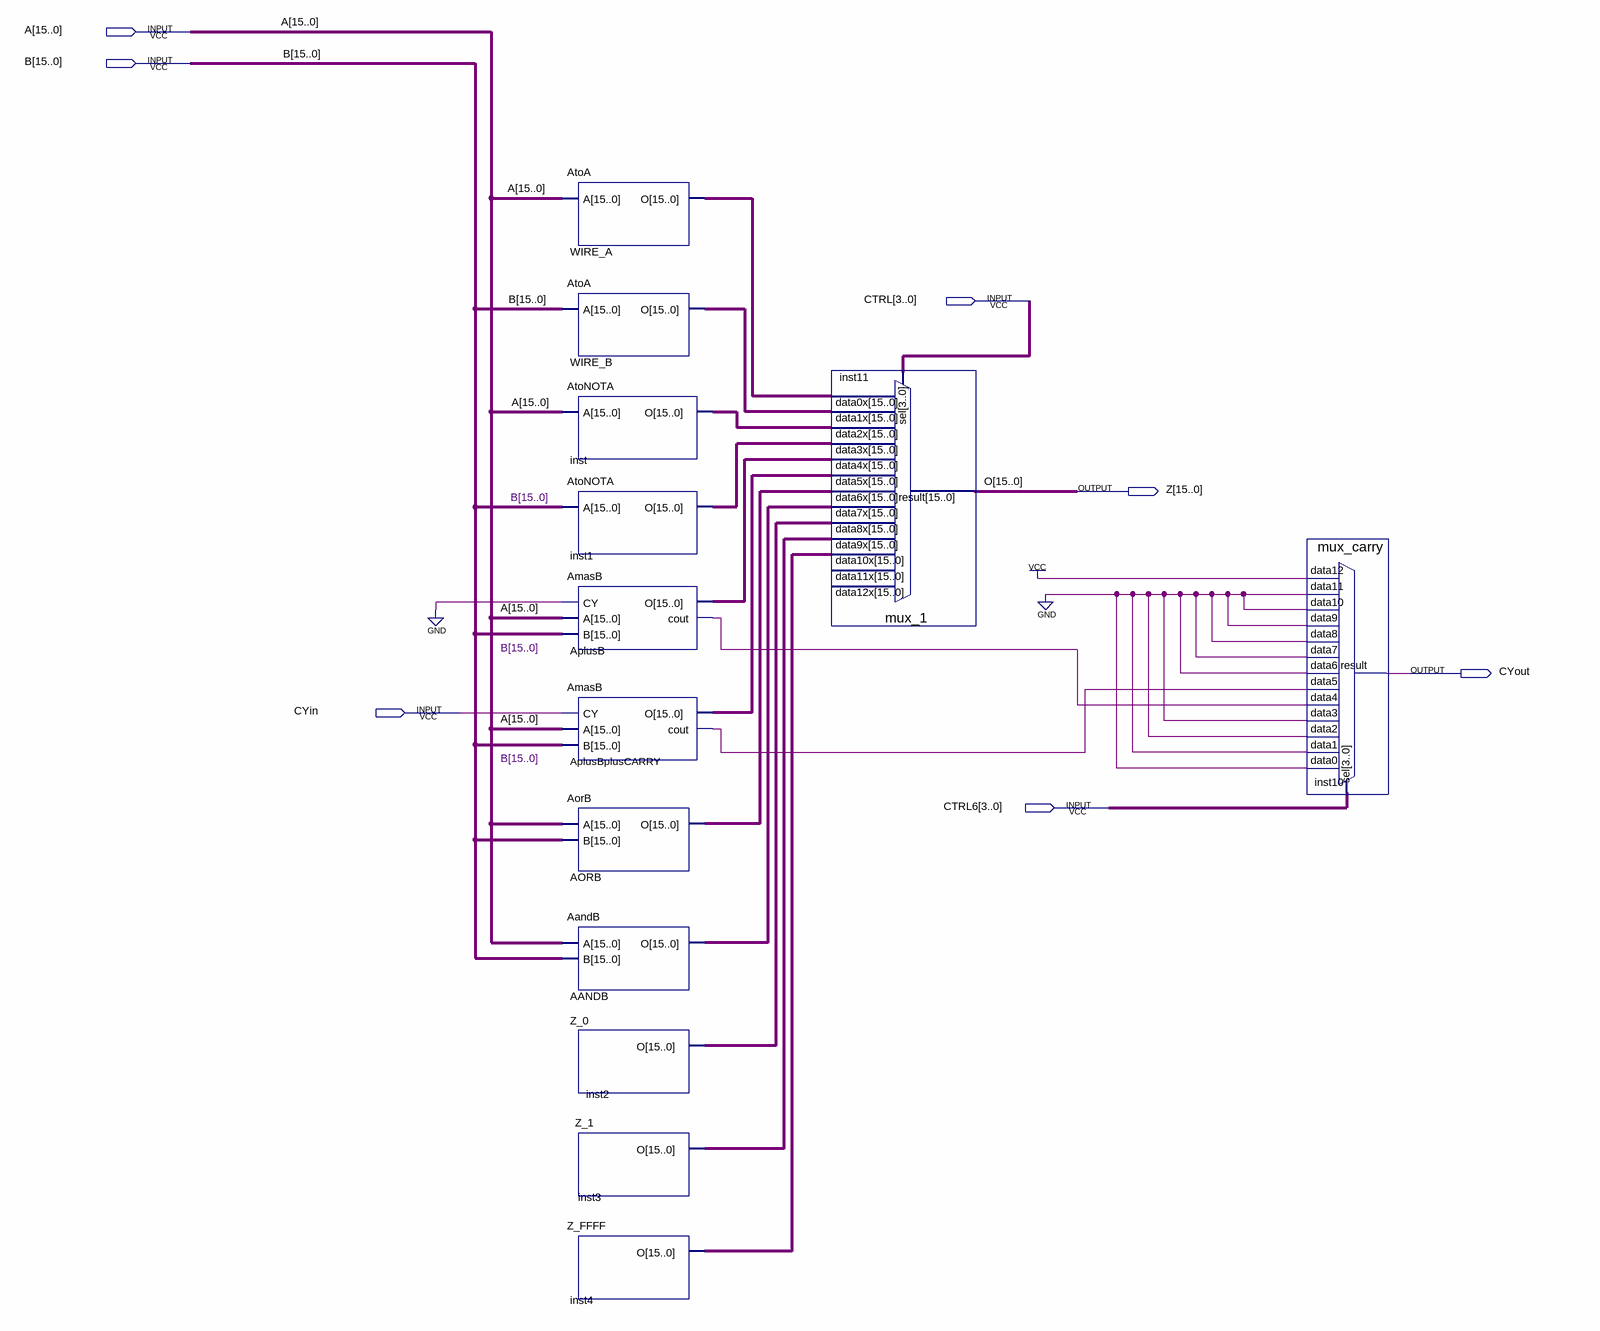
[diagram p0: schematic sheet]
// Quartus schematic ALU.bdf as structural Verilog: 13 symbols, 7 pins
module ALU (
  input  [15:0] A,
  input  [15:0] B,
  input  [3:0] CTRL,
  input  CYin,
  input  [3:0] CTRL6,
  output [15:0] Z,
  output CYout
);

  wire AplusB_cout, AplusBplusCARRY_cout;
  wire [15:0] AANDB_o, AORB_o, AplusB_o, AplusBplusCARRY_o, inst1_o, inst2_o, inst3_o, inst4_o, inst_o,
       WIRE_A_o, WIRE_B_o;

  AtoA WIRE_A (.A(A), .O(WIRE_A_o));
  AtoA WIRE_B (.A(B), .O(WIRE_B_o));
  AtoNOTA inst (.A(A), .O(inst_o));
  AtoNOTA inst1 (.A(B), .O(inst1_o));
  AmasB AplusB (.CY(1'b0), .A(A), .B(B), .O(AplusB_o), .cout(AplusB_cout));
  AmasB AplusBplusCARRY (.CY(CYin), .A(A), .B(B), .O(AplusBplusCARRY_o), .cout(AplusBplusCARRY_cout));
  AorB AORB (.A(A), .B(B), .O(AORB_o));
  AandB AANDB (.A(A), .B(B), .O(AANDB_o));
  Z_0 inst2 (.O(inst2_o));
  Z_1 inst3 (.O(inst3_o));
  Z_FFFF inst4 (.O(inst4_o));
  mux_1 inst11 (
    .data10x(inst4_o), .data9x(inst3_o), .data8x(inst2_o), .data7x(AANDB_o), .data6x(AORB_o),
    .data5x(AplusBplusCARRY_o), .data4x(AplusB_o), .data3x(inst1_o), .data2x(inst_o), .data1x(WIRE_B_o),
    .data0x(WIRE_A_o), .sel(CTRL), .result(Z));  // open: data12x, data11x
  mux_carry inst10 (
    .data12(1'b1), .data11(1'b0), .data10(1'b0), .data9(1'b0), .data8(1'b0), .data7(1'b0), .data6(1'b0),
    .data5(AplusBplusCARRY_cout), .data4(AplusB_cout), .data3(1'b0), .data2(1'b0), .data1(1'b0),
    .data0(1'b0), .sel(CTRL6), .result(CYout));

  // Other names for the same wires on the sheet: O[15:0] = Z
endmodule
